# EAGLE design brain (EAGLE 7.2.0)
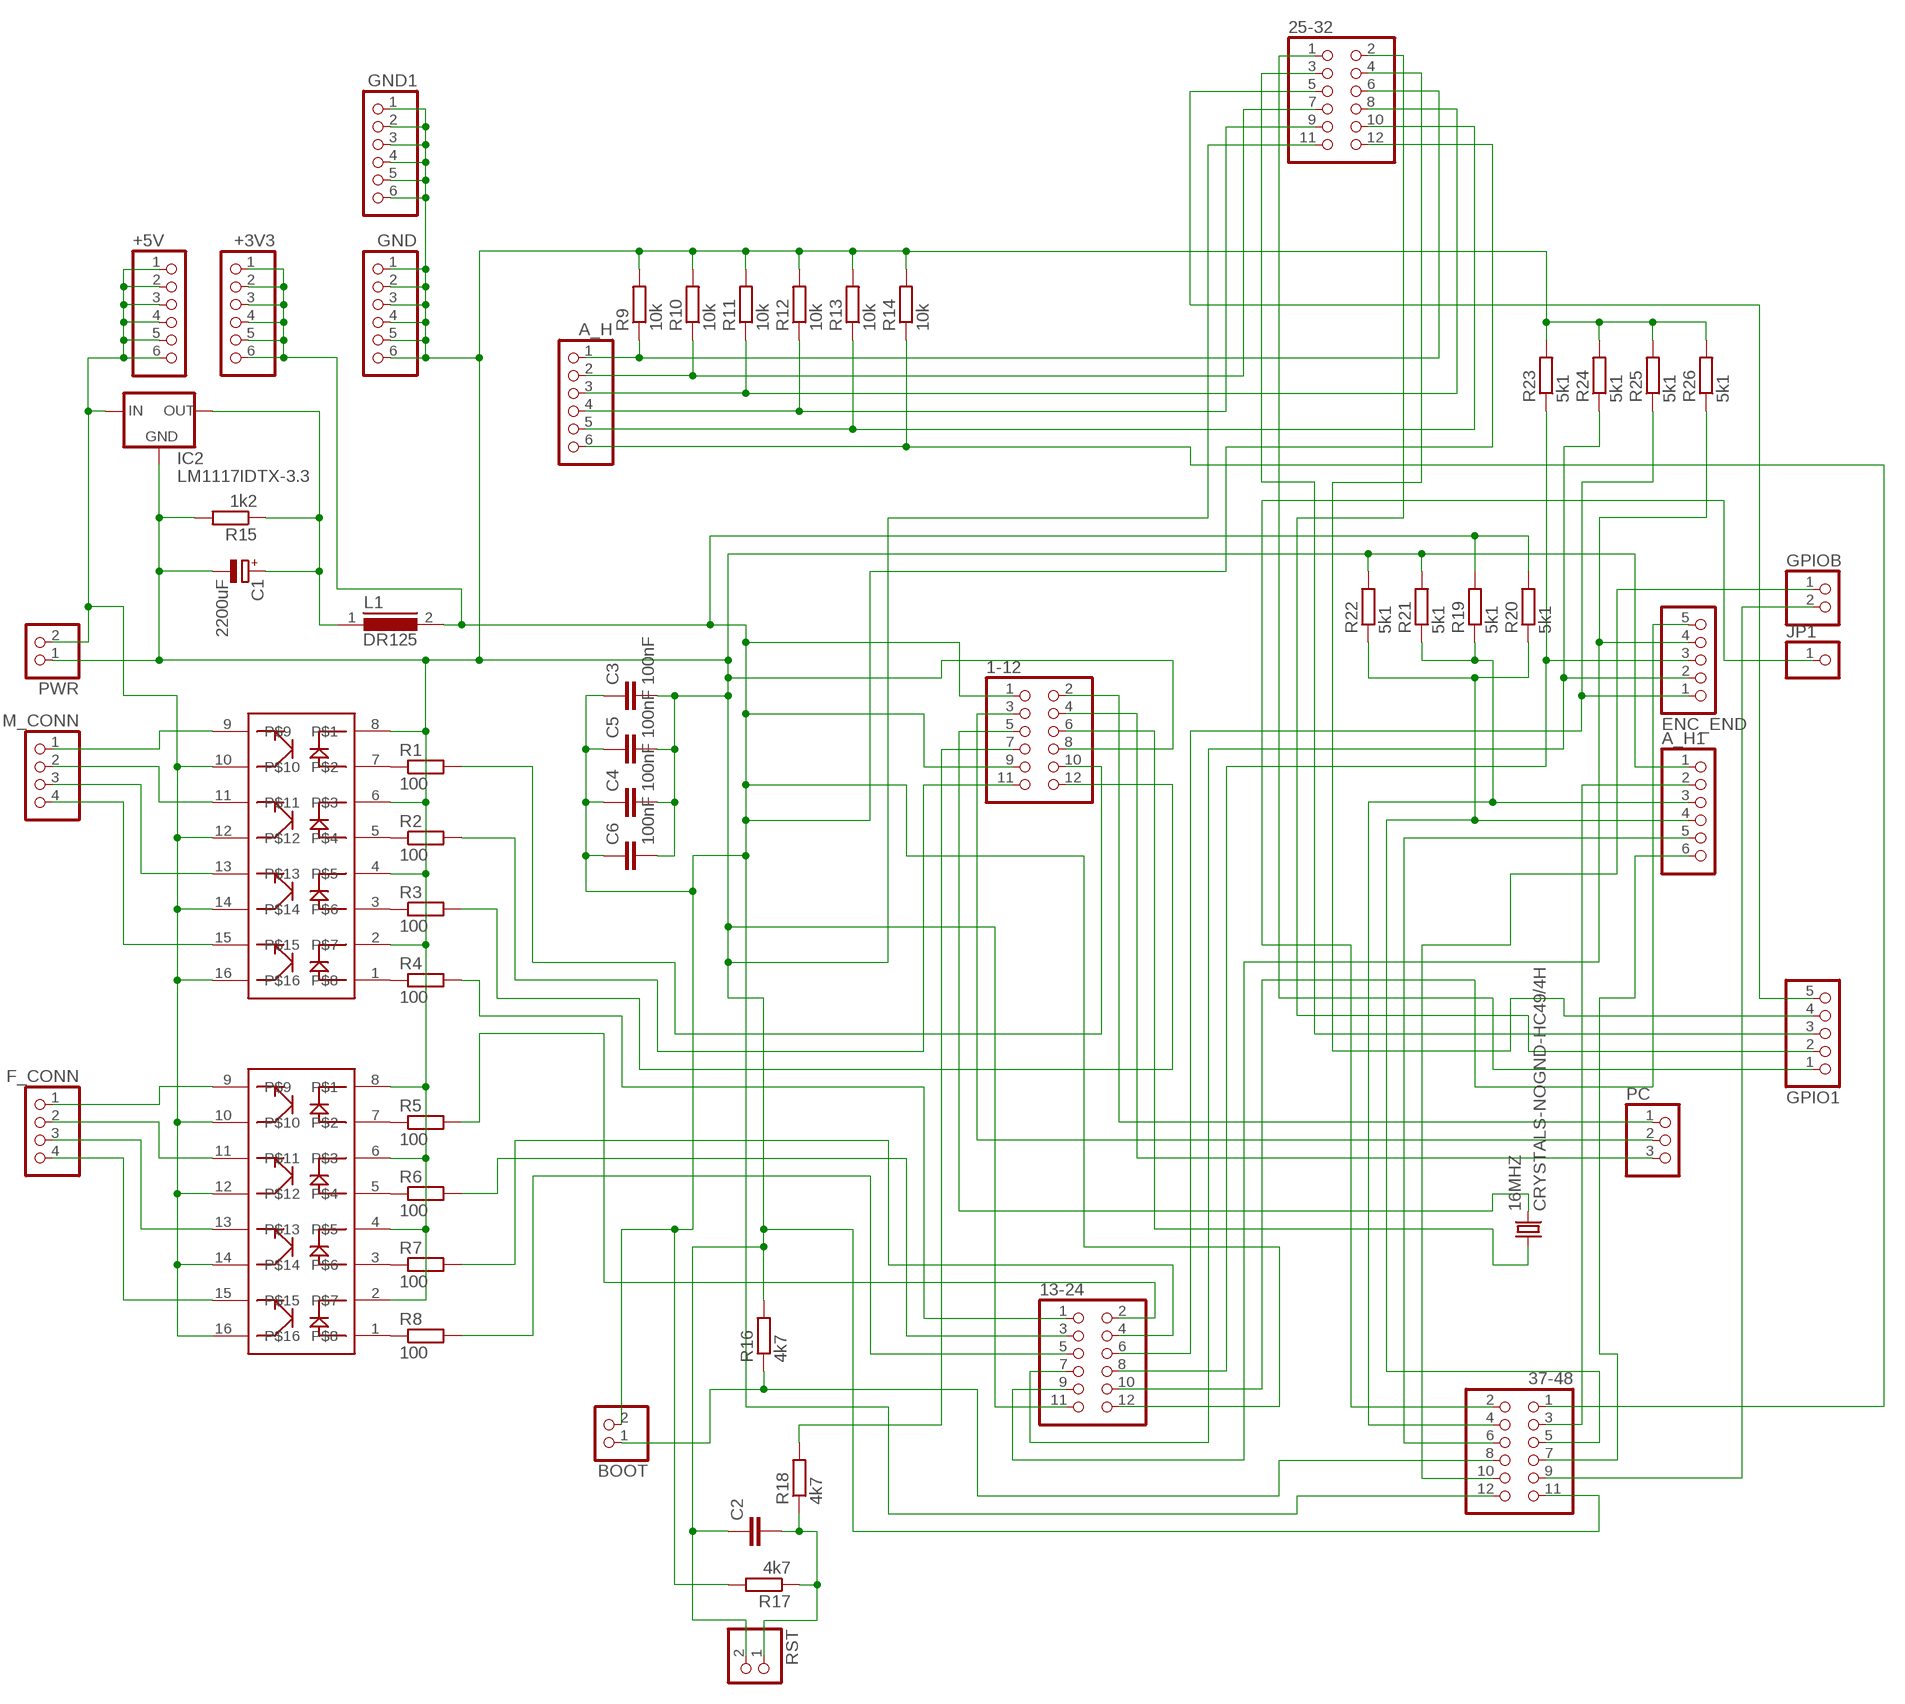
[diagram p0: schematic, sheet 1]

## Parts
1-12  PINHD-2X6  [2X06]
13-24  PINHD-2X6  [2X06]
16MHZ  CRYSTALS-NOGND-HC49/4H  [HC49]
25-32  PINHD-2X6  [2X06]
37-48  PINHD-2X6  [2X06]
+3V3  PINHD-1X6  [1X06]
+5V  PINHD-1X6  [1X06]
A_H  PINHD-1X6  [1X06]
A_H1  PINHD-1X6  [1X06]
BOOT  PINHD-1X2  [1X02]
C1  2200uF  CPOL-EUB45181D  [B45181D]
C2  C-EUC1206  [C1206]
C3  100nF  C-EUC0805  [C0805]
C4  100nF  C-EUC0805  [C0805]
C5  100nF  C-EUC0805  [C0805]
C6  100nF  C-EUC0805  [C0805]
ENC_END  PINHD-1X5  [1X05]
F_CONN  PINHD-1X4  [1X04]
F_OPTO  LTV847  [DIL16]
GND  PINHD-1X6  [1X06]
GND1  PINHD-1X6  [1X06]
GPIO1  PINHD-1X5  [1X05]
GPIOB  PINHD-1X2  [1X02]
IC2  LM1117IDTX-3.3  [TO252]
JP1  PINHD-1X1  [1X01]
L1  DR125  [DR125]
M_CONN  PINHD-1X4  [1X04]
M_OPTO  LTV847  [DIL16]
PC  PINHD-1X3  [1X03]
PWR  PINHD-1X2  [1X02]
R1  100  R-EU_R1206  [R1206]
R2  100  R-EU_R1206  [R1206]
R3  100  R-EU_R1206  [R1206]
R4  100  R-EU_R1206  [R1206]
R5  100  R-EU_R1206  [R1206]
R6  100  R-EU_R1206  [R1206]
R7  100  R-EU_R1206  [R1206]
R8  100  R-EU_R1206  [R1206]
R9  10k  R-EU_R1206  [R1206]
R10  10k  R-EU_R1206  [R1206]
R11  10k  R-EU_R1206  [R1206]
R12  10k  R-EU_R1206  [R1206]
R13  10k  R-EU_R1206  [R1206]
R14  10k  R-EU_R1206  [R1206]
R15  1k2  R-EU_R1206  [R1206]
R16  4k7  R-EU_R1206  [R1206]
R17  4k7  R-EU_R1206  [R1206]
R18  4k7  R-EU_R1206  [R1206]
R19  5k1  R-EU_R1206  [R1206]
R20  5k1  R-EU_R1206  [R1206]
R21  5k1  R-EU_R1206  [R1206]
R22  5k1  R-EU_R1206  [R1206]
R23  5k1  R-EU_R1206  [R1206]
R24  5k1  R-EU_R1206  [R1206]
R25  5k1  R-EU_R1206  [R1206]
R26  5k1  R-EU_R1206  [R1206]
RST  PINHD-1X2  [1X02]

## Nets
N$1: 1-12.8 13-24.11 25-32.11 37-48.11 A_H1.1 C1.- C2.1 C3.2 C4.2 C5.2 C6.2 F_OPTO.2 F_OPTO.4 F_OPTO.6 F_OPTO.8 GND1.1 GND1.2 GND1.3 GND1.4 GND1.5 GND1.6 GND.1 GND.2 GND.3 GND.4 GND.5 GND.6 IC2.1(GND) M_OPTO.2 M_OPTO.4 M_OPTO.6 M_OPTO.8 PWR.1 R9.2 R10.2 R11.2 R12.2 R13.2 R14.2 R15.2 R16.2 R21.2 R22.2 R23.2 R24.2 R25.2 R26.2 RST.2
N$2: +5V.1 +5V.2 +5V.3 +5V.4 +5V.5 +5V.6 F_OPTO.10 F_OPTO.12 F_OPTO.14 F_OPTO.16 IC2.2(IN) M_OPTO.10 M_OPTO.12 M_OPTO.14 M_OPTO.16 PWR.2
N$3: M_OPTO.7 R1.1
N$4: M_OPTO.5 R2.1
N$5: M_OPTO.3 R3.1
N$6: M_OPTO.1 R4.1
N$7: F_OPTO.7 R5.1
N$8: F_OPTO.5 R6.1
N$9: F_OPTO.3 R7.1
N$10: F_OPTO.1 R8.1
N$11: 1-12.10 R1.2
N$12: 13-24.1 R4.2
N$13: 37-48.2 JP1.1
N$15: C2.2 R17.1 R18.1 RST.1
N$16: 13-24.3 R6.2
N$17: 13-24.4 R7.2
N$18: 13-24.5 R8.2
N$19: M_CONN.1 M_OPTO.9
N$20: M_CONN.2 M_OPTO.11
N$21: M_CONN.3 M_OPTO.13
N$22: M_CONN.4 M_OPTO.15
N$23: F_CONN.1 F_OPTO.9
N$24: F_CONN.2 F_OPTO.11
N$25: F_CONN.3 F_OPTO.13
N$26: F_CONN.4 F_OPTO.15
N$27: 25-32.6 A_H.1 R9.1
N$28: 25-32.7 A_H.2 R10.1
N$29: 25-32.8 A_H.3 R11.1
N$30: 25-32.9 A_H.4 R12.1
N$31: 25-32.10 A_H.5 R13.1
N$32: 37-48.1 A_H.6 R14.1
N$34: 1-12.1 1-12.9 13-24.12 25-32.12 37-48.12 +3V3.1 +3V3.2 +3V3.3 +3V3.4 +3V3.5 +3V3.6 BOOT.2 C3.1 C4.1 C5.1 C6.1 L1.2 R17.2 R19.2 R20.2
N$36: 1-12.5 16MHZ.2
N$37: C1.+ IC2.TAB(OUT) L1.1 R15.1
N$38: 1-12.6 16MHZ.1
N$39: 37-48.8 BOOT.1 R16.1
N$40: 13-24.6 ENC_END.1 R25.1
N$41: 1-12.7 R18.2
N$43: 37-48.7 A_H1.6
N$44: 37-48.6 A_H1.5
N$45: 37-48.5 A_H1.4 R20.1 R22.1
N$46: 13-24.7 ENC_END.2 R24.1
N$47: 37-48.3 A_H1.2
N$48: 13-24.8 ENC_END.3 R23.1
N$49: 37-48.4 A_H1.3 R19.1 R21.1
N$50: 13-24.9 ENC_END.4 R26.1
N$51: 1-12.2 PC.1
N$52: 1-12.3 PC.2
N$53: 1-12.4 PC.3
N$54: 13-24.10 ENC_END.5
N$55: 25-32.1 GPIO1.1
N$56: 25-32.2 GPIO1.2
N$57: 25-32.3 GPIO1.3
N$58: 25-32.4 GPIO1.4
N$59: 25-32.5 GPIO1.5
N$61: 37-48.9 GPIOB.2
N$62: 37-48.10 GPIOB.1
N$64: 1-12.11 R2.2
N$65: 1-12.12 R3.2
N$66: 13-24.2 R5.2

## Library data of the parts
1-12 13-24 25-32 37-48 = pinhead:PINHD-2X6: PIN HEADER
16MHZ = IQD-Frequency-Products:CRYSTALS-NOGND: CRYSTALS CAN NOT GROUNDED
+3V3 +5V A_H A_H1 GND GND1 = pinhead:PINHD-1X6: PIN HEADER
BOOT GPIOB PWR RST = pinhead:PINHD-1X2: PIN HEADER
C1 = resistor:CPOL-EU: POLARIZED CAPACITOR, European symbol
C2-C6 = resistor:C-EU: CAPACITOR, European symbol
ENC_END GPIO1 = pinhead:PINHD-1X5: PIN HEADER
F_CONN M_CONN = pinhead:PINHD-1X4: PIN HEADER
F_OPTO M_OPTO = optocoupler:LTV847: LTV847 4-optocoupler DIP16
IC2 = lm1117:LM1117IDTX-*
JP1 = pinhead:PINHD-1X1: PIN HEADER
L1 = inductors:DR125: High Power Density, High Efficiency, Shielded Inductors Source: coiltronics_dr_series.pdf
PC = pinhead:PINHD-1X3: PIN HEADER
R1-R26 = resistor:R-EU_: RESISTOR, European symbol

## Board
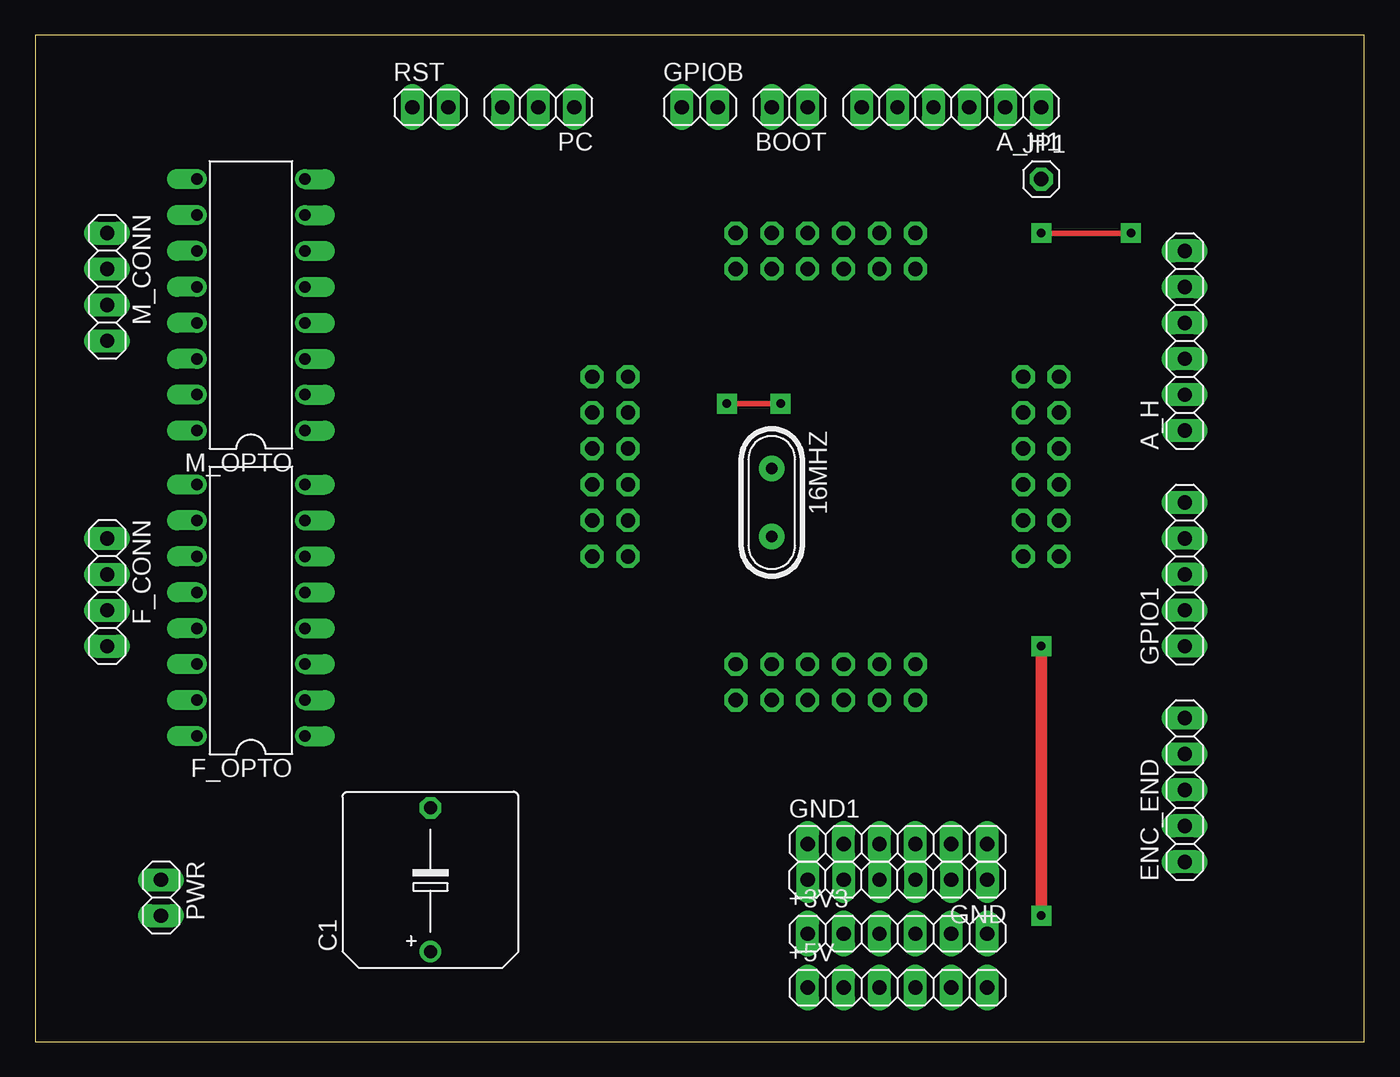
[diagram p1: board, top side]
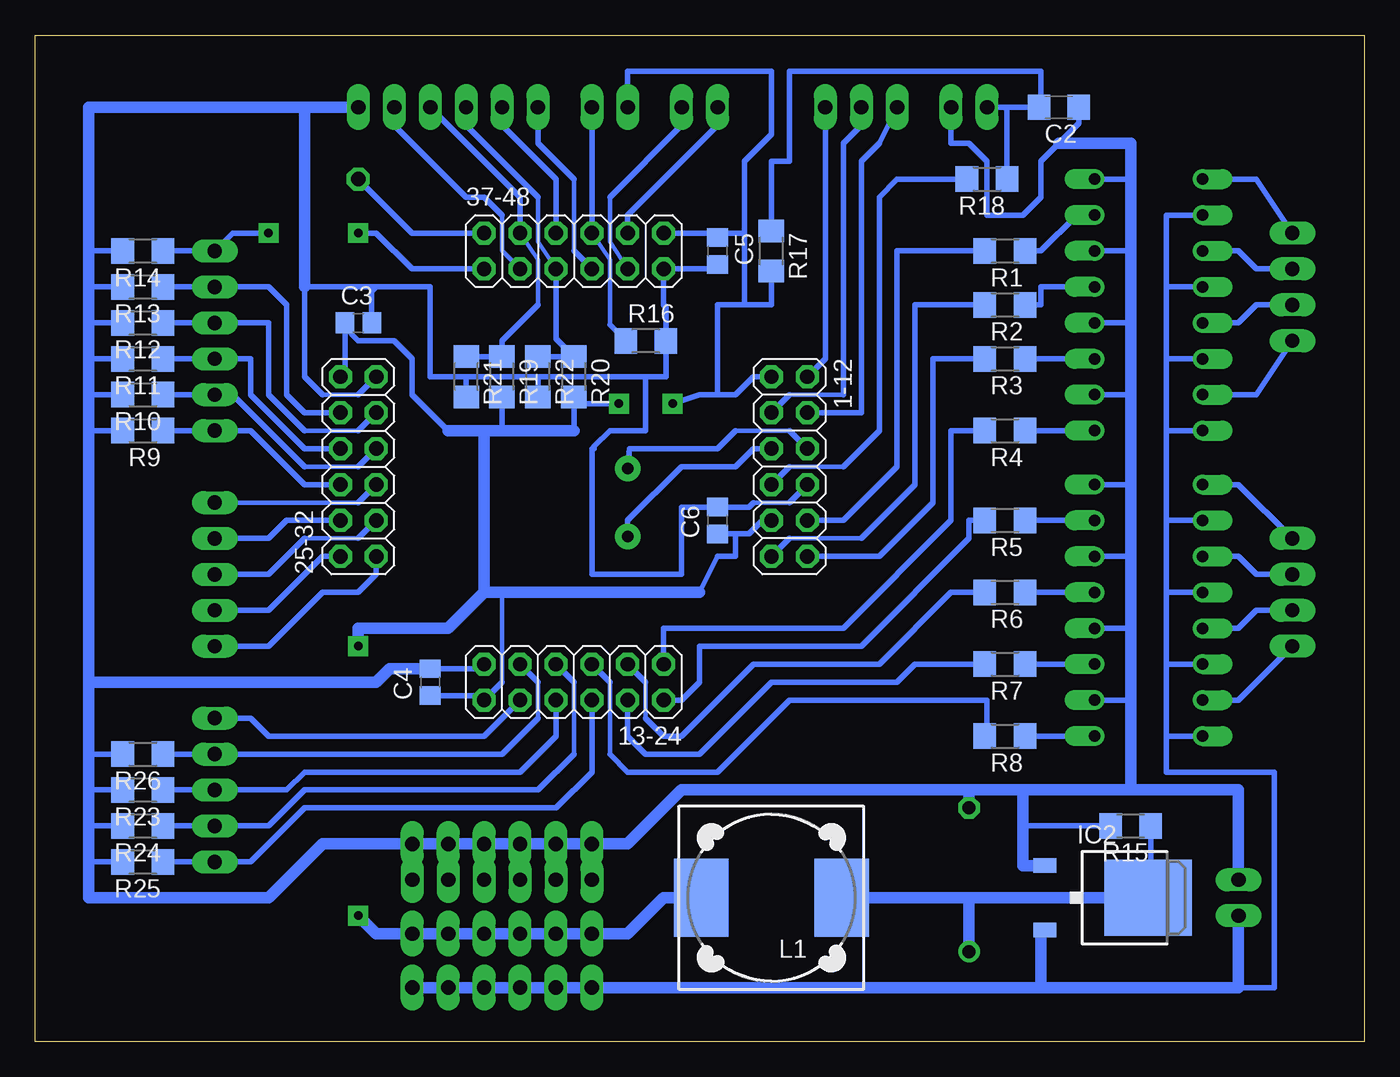
[diagram p2: board, bottom side, seen from below]

Size 93.96 x 71.12 mm. Coordinates in mm from the lower left corner, seen from the top.
Outline: 0,0 93.96,0 93.96,71.12 0,71.12 0,0
Copper layers (1*16): Top 0.035mm / dielectric 1.5mm / Bottom 0.035mm
Design rules "default *": minimum track width 10mil, minimum drill 24mil, track to track 8mil, track to pad 8mil, pad to pad 8mil, via to via 8mil, smd to smd 8mil, copper to edge 40mil, drill to drill 8mil, minimum pad ring 12mil, minimum via ring 16mil, stop-mask expansion 4mil, vias tented up to drill 0mil, thermal gap 10mil

### Footprints (pad centres in the part's own frame; a part is rotated, then mirrored left to right if it is on the bottom)
2X06 = drill 1.016 octagon: 1 -6.35,-1.27; 2 -6.35,1.27; 3 -3.81,-1.27; 4 -3.81,1.27; 5 -1.27,-1.27; 6 -1.27,1.27; 7 1.27,-1.27; 8 1.27,1.27; 9 3.81,-1.27; 10 3.81,1.27; 11 6.35,-1.27; 12 6.35,1.27
HC49 = drill 0.813 pad 1.8: 1 -2.413,0; 2 2.413,0
1X06 = drill 1.016 long: 1 -6.35,0; 2 -3.81,0; 3 -1.27,0; 4 1.27,0; 5 3.81,0; 6 6.35,0
1X02 = drill 1.016 long: 1 -1.27,0; 2 1.27,0
B45181D = drill 0.914: + -5.08,0 | drill 0.914 octagon: - 5.08,0
C1206 = smd 1.6 x 1.8: 1 -1.4,0; 2 1.4,0
C0805 = smd 1.3 x 1.5: 1 -0.95,0; 2 0.95,0
1X05 = drill 1.016 long: 1 -5.08,0; 2 -2.54,0; 3 0,0; 4 2.54,0; 5 5.08,0
1X04 = drill 1.016 long: 1 -3.81,0; 2 -1.27,0; 3 1.27,0; 4 3.81,0
DIL16 = drill 0.813 offset: 1 -8.89,-3.81; 2 -6.35,-3.81; 3 -3.81,-3.81; 4 -1.27,-3.81; 5 1.27,-3.81; 6 3.81,-3.81; 7 6.35,-3.81; 8 8.89,-3.81; 9 8.89,3.81; 10 6.35,3.81; 11 3.81,3.81; 12 1.27,3.81; 13 -1.27,3.81; 14 -3.81,3.81; 15 -6.35,3.81; 16 -8.89,3.81
TO252 = smd 1 x 1.6: 1 -2.28,-4.8; 2 2.28,-4.8 | smd 5.4 x 6.2: TAB 0,2.5
1X01 = drill 1.016 octagon: 1 0,0
DR125 = smd 3.85 x 5.5: 1 -4.975,0; 2 4.975,0
1X03 = drill 1.016 long: 1 -2.54,0; 2 0,0; 3 2.54,0
R1206 = smd 1.6 x 1.803: 1 -1.422,0; 2 1.422,0

### Placement (x,y rotation side)
1-12  40.64,40.64 270 bottom
13-24  55.88,25.4 180 bottom
16MHZ  52.07,38.1 270 top
25-32  71.12,40.64 90 bottom
37-48  55.88,55.88 0 bottom
+3V3  60.96,7.62 0 top
+5V  60.96,3.81 0 top
A_H  81.28,49.53 90 top
A_H1  64.77,66.04 180 top
BOOT  53.34,66.04 180 top
C1  27.94,11.43 90 top
C2  21.59,66.04 180 bottom
C3  71.12,50.8 0 bottom
C4  66.04,25.4 90 bottom
C5  45.72,55.88 270 bottom
C6  45.72,36.83 90 bottom
ENC_END  81.28,17.78 90 top
F_CONN  5.08,31.75 270 top
F_OPTO  15.24,30.48 90 top
GND  60.96,11.43 180 top
GND1  60.96,13.97 0 top
GPIO1  81.28,33.02 90 top
GPIOB  46.99,66.04 0 top
IC2  17.78,10.16 270 bottom
JP1  71.12,60.96 0 top
L1  41.91,10.16 180 bottom
M_CONN  5.08,53.34 270 top
M_OPTO  15.24,52.07 90 top
PC  35.56,66.04 180 top
PWR  8.89,10.16 270 top
R1  25.4,55.88 180 bottom
R2  25.4,52.07 180 bottom
R3  25.4,48.26 180 bottom
R4  25.4,43.18 180 bottom
R5  25.4,36.83 180 bottom
R6  25.4,31.75 180 bottom
R7  25.4,26.67 180 bottom
R8  25.4,21.59 180 bottom
R9  86.36,43.18 180 bottom
R10  86.36,45.72 180 bottom
R11  86.36,48.26 180 bottom
R12  86.36,50.8 180 bottom
R13  86.36,53.34 180 bottom
R14  86.36,55.88 180 bottom
R15  16.51,15.24 180 bottom
R16  50.8,49.53 0 bottom
R17  41.91,55.88 270 bottom
R18  26.67,60.96 180 bottom
R19  60.96,46.99 270 bottom
R20  55.88,46.99 270 bottom
R21  63.5,46.99 270 bottom
R22  58.42,46.99 270 bottom
R23  86.36,17.78 180 bottom
R24  86.36,15.24 180 bottom
R25  86.36,12.7 180 bottom
R26  86.36,20.32 180 bottom
RST  27.94,66.04 0 top

### Tracks (layer width: path | path; a pad name or v marks a point on that pad's centre or on a via)
N$1
  Bottom 0.305: 43.18,38.1 40.64,38.1 | 71.12,45.72 73.66,45.72
  Bottom 0.406: R14.2 90.17,55.88 | R13.2 90.17,53.34 | R12.2 90.17,50.8 | R11.2 90.17,48.26 | R10.2 90.17,45.72 | 87.63,43.18 R9.2 90.17,43.18 | R26.2 90.17,20.32 | R23.2 90.17,17.78 | R24.2 90.17,15.24 | R25.2 90.17,12.7 | R15.2 24.13,15.24 | R22.2 58.42,46.99 | 58.42,46.99 63.5,46.99 | 63.5,46.99 R21.2 | 63.5,46.99 66.04,46.99 66.04,53.34 69.85,53.34 | 50.8,46.99 49.38,46.99 R16.2 49.38,51.92 49.53,52.07 37-48.11 46.04,54.61 C5.2 | 50.8,46.99 58.42,46.99 | C2.1 20.19,64.9 21.59,63.5 22.86,62.23 22.86,59.69 24.13,58.42 26.67,58.42 26.67,62.23 27.94,63.5 29.21,63.5 RST.2 | 50.8,46.99 50.8,43.18 53.34,43.18 54.46,42.06 54.46,41.91 54.61,41.91 54.61,33.02 48.26,33.02 48.26,37.78 C6.2 43.5,37.78 43.18,38.1 | 69.85,53.34 74.93,53.34 74.93,46.99 73.66,45.72 | F_OPTO.2 16.51,24.13 | F_OPTO.4 16.51,29.21 | F_OPTO.6 16.51,34.29 | F_OPTO.8 16.51,39.37 | M_OPTO.2 16.51,45.72 | M_OPTO.4 16.51,50.8 | M_OPTO.6 16.51,55.88 | M_OPTO.8 16.51,60.96 | 40.64,38.1 1-12.8 | 13-24.11 62.55,26.35 C4.2 | C3.2 70.17,53.02 69.85,53.34 | 25-32.11 71.12,45.72
  Bottom 0.813: PWR.1 8.89,17.78 16.51,17.78 | 16.51,17.78 24.13,17.78 | 24.13,17.78 27.94,17.78 | 27.94,17.78 48.26,17.78 52.07,13.97 GND1.1 | GND1.1 GND1.2 | GND1.2 GND1.3 | GND1.3 GND1.4 | GND1.4 GND1.5 | GND1.5 GND1.6 | 90.17,25.4 90.17,20.32 90.17,17.78 90.17,15.24 90.17,12.7 90.17,10.16 77.47,10.16 73.66,13.97 GND1.6 | 90.17,25.4 90.17,43.18 90.17,45.72 90.17,48.26 90.17,50.8 90.17,53.34 90.17,55.88 90.17,66.04 74.93,66.04 | GND.1 GND1.6 | GND.2 GND1.5 | GND.3 GND1.4 | GND.4 GND1.3 | GND.5 GND1.2 | GND.6 GND1.1 | C1.- 27.94,17.78 | IC2.1 24.13,12.44 24.13,15.24 24.13,17.78 | 74.93,66.04 A_H1.1 | GND1.4 GND1.6 | 90.17,25.4 69.85,25.4 68.9,26.35 C4.2 | 74.93,53.34 74.93,66.04 | 16.51,17.78 16.51,24.13 16.51,29.21 16.51,34.29 16.51,39.37 16.51,45.72 16.51,50.8 16.51,55.88 16.51,60.96 16.51,63.5 21.59,63.5
N$2
  Bottom 0.406: M_OPTO.10 13.97,58.42 13.97,53.34 | 13.97,53.34 13.97,48.26 | 13.97,48.26 13.97,43.18 | 13.97,43.18 13.97,36.83 | 13.97,36.83 13.97,31.75 | 13.97,31.75 13.97,26.67 | 13.97,26.67 13.97,21.59 | F_OPTO.14 13.97,26.67 | F_OPTO.12 13.97,31.75 | F_OPTO.10 13.97,36.83 | M_OPTO.16 13.97,43.18 | M_OPTO.14 13.97,48.26 | M_OPTO.12 13.97,53.34 | F_OPTO.16 13.97,21.59 | 13.97,21.59 13.97,19.05 6.35,19.05 6.35,3.81 8.89,3.81
  Bottom 0.813: PWR.2 8.89,3.81 22.86,3.81 | 22.86,3.81 +5V.1 +5V.2 +5V.3 +5V.4 +5V.5 +5V.6 | IC2.2 22.86,7.88 22.86,3.81
N$3
  Bottom 0.406: M_OPTO.7 20.32,58.42 22.86,55.88 R1.1
N$4
  Bottom 0.406: R2.1 22.86,52.07 22.86,53.34 M_OPTO.5
N$5
  Bottom 0.406: R3.1 M_OPTO.3
N$6
  Bottom 0.406: R4.1 M_OPTO.1
N$7
  Bottom 0.406: R5.1 F_OPTO.7
N$8
  Bottom 0.406: R6.1 F_OPTO.5
N$9
  Bottom 0.406: R7.1 F_OPTO.3
N$10
  Bottom 0.406: R8.1 F_OPTO.1
N$11
  Bottom 0.406: R1.2 33.02,55.88 33.02,40.64 36.83,36.83 1-12.10
N$12
  Bottom 0.406: R4.2 29.21,43.18 29.21,36.83 36.83,29.21 49.53,29.21 13-24.1
N$13
  Bottom 0.406: 71.75,60.96 JP1.1 67.31,57.15 37-48.2
N$15
  Bottom 0.406: 25.4,66.04 C2.2 22.86,66.04 22.86,68.58 40.64,68.58 40.64,62.23 41.91,62.23 R17.1 | 25.4,66.04 RST.1 | R18.1 25.25,65.89 25.4,66.04
N$16
  Bottom 0.305: 50.8,22.86 50.8,25.4
  Bottom 0.406: R6.2 29.21,31.75 34.29,26.67 43.18,26.67 48.26,21.59 49.53,21.59 50.8,22.86 | 50.8,25.4 13-24.3
N$17
  Bottom 0.406: 26.67,26.67 R7.2 31.75,26.67 33.02,25.4 41.91,25.4 46.99,20.32 50.8,20.32 52.07,21.59 13-24.4
N$18
  Bottom 0.305: 53.34,20.32 53.34,25.4
  Bottom 0.406: R8.2 26.67,21.59 26.67,24.13 40.64,24.13 45.72,19.05 52.07,19.05 53.34,20.32 | 53.34,25.4 13-24.5
N$19
  Bottom 0.406: M_OPTO.9 7.62,60.96 M_CONN.1
N$20
  Bottom 0.406: M_OPTO.11 8.89,55.88 7.62,54.61 M_CONN.2
N$21
  Bottom 0.406: M_OPTO.13 8.89,50.8 7.62,52.07 M_CONN.3
N$22
  Bottom 0.406: M_OPTO.15 7.62,45.72 M_CONN.4
N$23
  Bottom 0.406: F_OPTO.9 8.89,39.37 F_CONN.1
N$24
  Bottom 0.406: F_OPTO.11 8.89,34.29 7.62,33.02 F_CONN.2
N$25
  Bottom 0.406: F_OPTO.13 8.89,29.21 7.62,30.48 F_CONN.3
N$26
  Bottom 0.406: F_OPTO.15 8.89,24.13 F_CONN.4
N$27
  Bottom 0.406: R9.1 A_H.1 78.74,43.18 74.93,39.37 25-32.6
N$28
  Bottom 0.305: 74.93,40.64 71.12,40.64
  Bottom 0.406: R10.1 A_H.2 80.01,45.72 74.93,40.64 | 71.12,40.64 25-32.7
N$29
  Bottom 0.406: R11.1 A_H.3 78.74,48.26 78.74,45.72 74.93,41.91 25-32.8
N$30
  Bottom 0.305: 74.93,43.18 71.12,43.18
  Bottom 0.406: R12.1 A_H.4 77.47,50.8 77.47,45.72 74.93,43.18 | 71.12,43.18 25-32.9
N$31
  Bottom 0.406: R13.1 A_H.5 77.47,53.34 76.2,52.07 76.2,45.72 74.93,44.45 25-32.10
N$32  (via drill 0.6)
  Top 0.406: v71.12,57.15 v77.47,57.15
  Bottom 0.406: R14.1 A_H.6 80.01,57.15 v77.47,57.15 | v71.12,57.15 69.85,57.15 67.31,54.61 37-48.1
N$34  (via drill 0.6)
  Top 0.406: v48.9,45.09 v52.7,45.09
  Top 0.813: v71.12,8.89 v71.12,27.94
  Bottom 0.305: 60.96,25.4 60.96,31.75
  Bottom 0.406: 45.72,45.72 45.72,52.07 43.81,52.07 | C6.1 44.45,35.88 | 44.45,35.88 43.5,35.88 42.55,36.83 1-12.9 | R20.2 55.88,43.18 | 60.96,43.18 R19.2 | 46.99,31.75 45.72,34.29 44.45,34.29 44.45,35.88 | R17.2 41.91,52.07 43.81,52.07 | BOOT.2 52.07,68.58 41.91,68.58 41.91,64.14 43.81,62.23 43.81,57.15 | 43.81,57.15 43.81,52.07 | 64.77,43.18 67.31,45.72 67.31,48.26 68.58,49.53 71.12,49.53 72.07,50.48 C3.1 72.07,47.31 25-32.12 | 55.73,45.72 R20.2 | v52.7,45.09 55.4,45.09 R20.2 | 45.72,45.72 46.99,45.72 v48.9,45.09 | 45.72,45.72 44.45,45.72 43.18,46.99 1-12.1 | 60.96,25.4 13-24.12 62.55,24.45 C4.1 | 37-48.12 46.04,57.15 C5.1 45.4,57.15 43.81,57.15
  Bottom 0.813: L1.2 49.53,10.16 52.07,7.62 +3V3.1 +3V3.2 +3V3.3 +3V3.4 +3V3.5 +3V3.6 69.85,7.62 v71.12,8.89 | 55.88,43.18 60.96,43.18 62.23,43.18 | 62.23,31.75 60.96,31.75 46.99,31.75 | 62.23,31.75 62.23,43.18 | 64.77,43.18 62.23,43.18 | v71.12,27.94 71.12,29.21 64.77,29.21 62.23,31.75
N$36
  Bottom 0.406: 16MHZ.2 52.07,36.83 48.26,40.64 44.45,40.64 43.18,41.91 1-12.5
N$37
  Bottom 0.406: R15.1 15.09,10.16 IC2.TAB
  Bottom 0.813: 27.94,10.16 L1.1 | C1.+ 27.94,10.16 | 27.94,10.16 IC2.TAB
N$38
  Bottom 0.305: 44.45,43.18 40.64,43.18
  Bottom 0.406: 16MHZ.1 51.94,41.91 45.72,41.91 44.45,43.18 | 40.64,43.18 1-12.6
N$39
  Bottom 0.305: 53.34,50.65 53.34,55.24 37-48.8
  Bottom 0.406: BOOT.1 37-48.8 | R16.1 53.34,50.65
N$40
  Bottom 0.406: R25.1 ENC_END.1 78.74,12.7 74.93,16.51 57.15,16.51 54.61,19.05 13-24.6
N$41
  Bottom 0.305: 36.83,40.64 40.64,40.64
  Bottom 0.406: R18.2 33.02,60.96 34.29,59.69 34.29,43.18 36.83,40.64 | 40.64,40.64 1-12.7
N$43
  Bottom 0.305: 55.88,60.96 55.88,55.88
  Bottom 0.406: A_H1.6 58.42,63.5 55.88,60.96 | 55.88,55.88 37-48.7
N$44
  Bottom 0.406: A_H1.5 60.96,64.77 57.15,60.96 37-48.6
N$45
  Bottom 0.305: 58.42,59.69 58.42,56.52 37-48.5
  Bottom 0.406: A_H1.4 63.5,64.77 58.42,59.69 | R22.1 R20.1 57.15,49.68 37-48.5
N$46
  Bottom 0.305: 55.88,20.32 55.88,25.4
  Bottom 0.406: R24.1 ENC_END.2 77.47,15.24 74.93,17.78 58.42,17.78 55.88,20.32 | 55.88,25.4 13-24.7
N$47
  Bottom 0.305: 60.96,58.42 60.96,55.88 37-48.3
  Bottom 0.406: A_H1.2 68.58,64.77 63.5,59.69 62.23,59.69 60.96,58.42
N$48
  Bottom 0.406: R23.1 ENC_END.3 76.2,17.78 74.93,19.05 59.69,19.05 57.15,21.59 13-24.8
N$49
  Bottom 0.305: 58.42,52.07 58.42,55.24 37-48.4
  Bottom 0.406: R21.1 R19.1 60.96,49.53 58.42,52.07 | A_H1.3 59.69,59.69 37-48.4
N$50
  Bottom 0.305: 58.42,22.86 58.42,25.4
  Bottom 0.406: R26.1 ENC_END.4 60.96,20.32 58.42,22.86 | 58.42,25.4 13-24.9
N$51
  Bottom 0.406: PC.1 38.1,48.26 1-12.2
N$52
  Bottom 0.305: 36.83,45.72 40.64,45.72
  Bottom 0.406: PC.2 35.56,64.77 36.83,63.5 36.83,45.72 | 40.64,45.72 1-12.3
N$53
  Bottom 0.406: PC.3 34.29,63.5 35.56,62.23 35.56,44.45 1-12.4
N$54
  Bottom 0.406: ENC_END.5 78.74,22.86 77.47,21.59 62.23,21.59 13-24.10
N$55
  Bottom 0.406: GPIO1.1 77.47,27.94 73.66,31.75 71.12,31.75 69.85,33.02 25-32.1
N$56
  Bottom 0.406: GPIO1.2 77.47,30.48 73.66,34.29 25-32.2
N$57
  Bottom 0.305: 74.93,35.56 71.12,35.56
  Bottom 0.406: GPIO1.3 77.47,33.02 74.93,35.56 | 71.12,35.56 25-32.3
N$58
  Bottom 0.406: GPIO1.4 77.47,35.56 76.2,36.83 25-32.4
N$59
  Bottom 0.305: GPIO1.5 71.12,38.1
  Bottom 0.406: 71.12,38.1 25-32.5
N$61
  Bottom 0.305: 53.34,59.69 53.34,56.52 37-48.9
  Bottom 0.406: GPIOB.2 48.26,64.77 53.34,59.69
N$62
  Bottom 0.406: GPIOB.1 45.72,64.77 52.07,58.42 37-48.10
N$64
  Bottom 0.305: 35.56,35.56 40.64,35.56
  Bottom 0.406: R2.2 31.75,52.07 31.75,39.37 35.56,35.56 | 40.64,35.56 1-12.11
N$65
  Bottom 0.406: R3.2 30.48,48.26 30.48,38.1 34.29,34.29 1-12.12
N$66
  Bottom 0.406: R5.2 27.94,36.83 27.94,35.56 35.56,27.94 46.99,27.94 46.99,25.4 48.26,24.13 13-24.2

### Text on the board
SIGNS: RST | BOOT | G | PB9 | PB8 | NSC | RDY | MO | MI | CLK | PA15 | PC15 | PC14 | PC13 | 1 | CLK | 2 | IO | SWD | 3 | DP | 4 | DM | M_MOTOR | USB | RX | TX | UART1 | PA8 | 1 | PB15 | 2 | PB14 | 3 | PB13 | 4 | PB12 | F_MOTOR | PB11 | D_S | U_S | F_E | GND | M_E | PWR | +3V3 | +5V